# EAGLE design UTDTestBox_Rev1 (EAGLE 5.06)
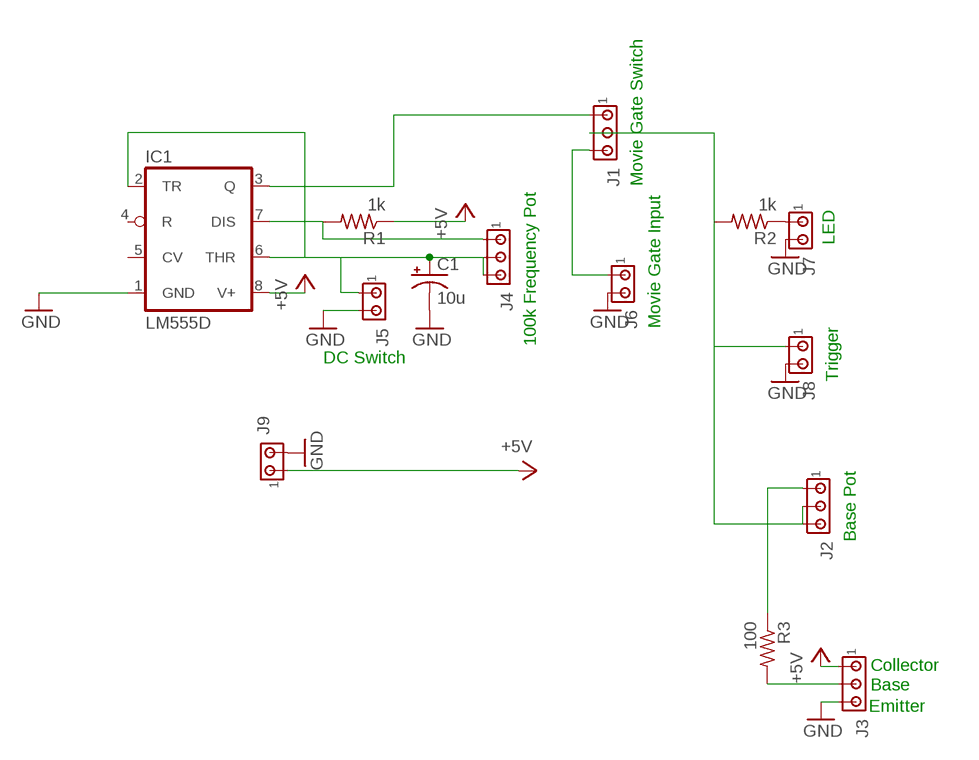
[diagram p0: schematic, sheet 1]

## Parts
C1  10u  CPOL-USE2.5-5  [E2,5-5]
IC1  LM555D  [SO08]
J1  MTA03-100  [10X03MTA]
J2  MTA03-100  [10X03MTA]
J3  MTA03-156  [1X3MTA]
J4  MTA03-100  [10X03MTA]
J5  MTA02-100  [10X02MTA]
J6  MTA02-100  [10X02MTA]
J7  MTA02-100  [10X02MTA]
J8  MTA02-100  [10X02MTA]
J9  MTA02-156  [1X2MTA]
R1  1k  R-US_0204/7  [0204/7]
R2  1k  R-US_0204/7  [0204/7]
R3  100  R-US_0204/7  [0204/7]

## Nets
+5V: IC1.8(V+) J3.1 J9.1 R1.1
GND: C1.- IC1.1(GND) J3.3 J5.2 J6.2 J7.2 J8.2 J9.2
N$1: C1.+ IC1.2(TR) IC1.6(THR) J4.2 J4.3 J5.1
N$2: IC1.7(DIS) J4.1 R1.2
N$3: IC1.3(Q) J1.1
N$4: J1.2 J2.2 J2.3 J8.1 R2.2
N$5: J1.3 J6.1
N$6: J7.1 R2.1
N$7: J2.1 R3.1
N$8: J3.2 R3.2
Unconnected: IC1.4(R) IC1.5(CV)

## Notes on the sheet
- Movie Gate Switch
- LED
- Movie Gate Input
- 100k Frequency Pot
- DC Switch
- Trigger
- Base Pot
- Collector
- Base
- Emitter

## Library data of the parts
C1 = rcl:CPOL-US: POLARIZED CAPACITOR, American symbol
IC1 = linear:*555: TIMER
J1 J2 J4 = con-amp:MTA03-100: AMP connector
J3 = con-amp:MTA03-156: AMP connector
J5-J8 = con-amp:MTA02-100: AMP connector
J9 = con-amp:MTA02-156: AMP connector
R1-R3 = rcl:R-US_: RESISTOR, American symbol

## Board
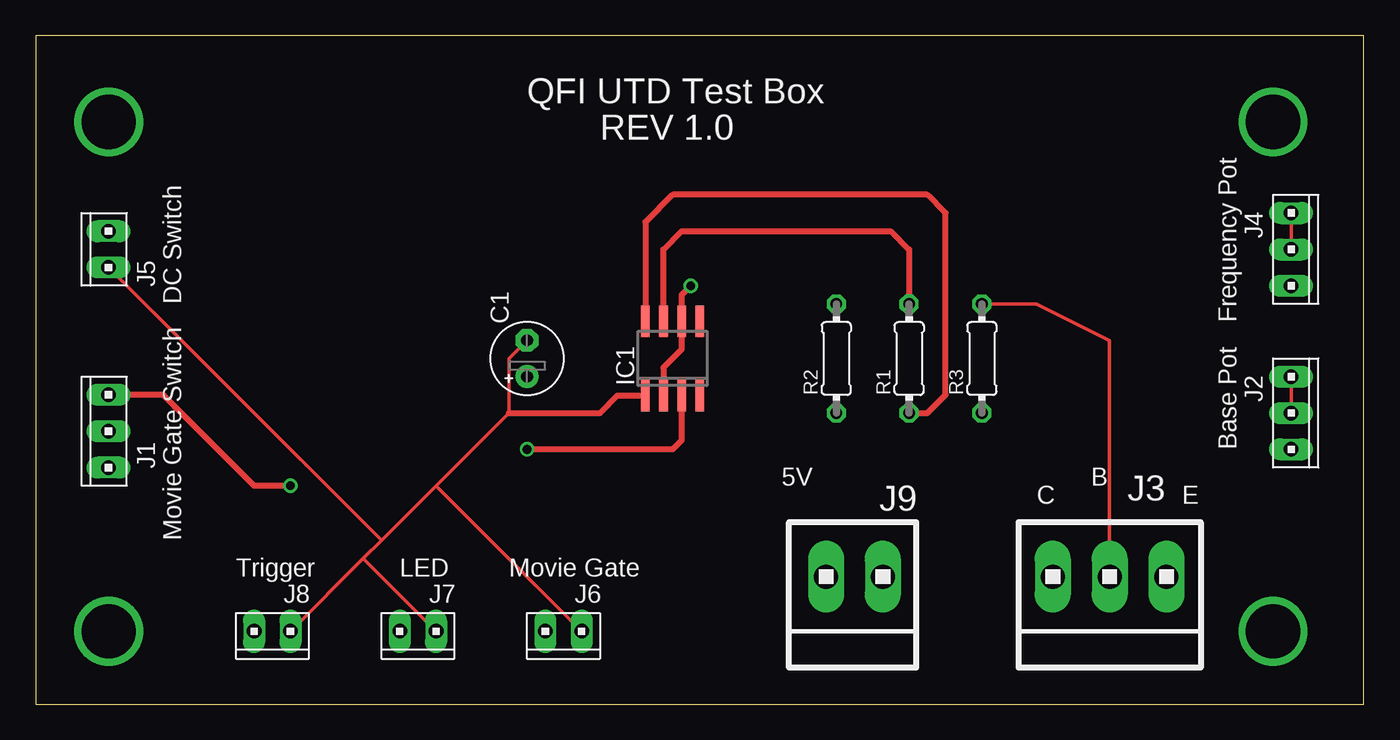
[diagram p1: board, top side]
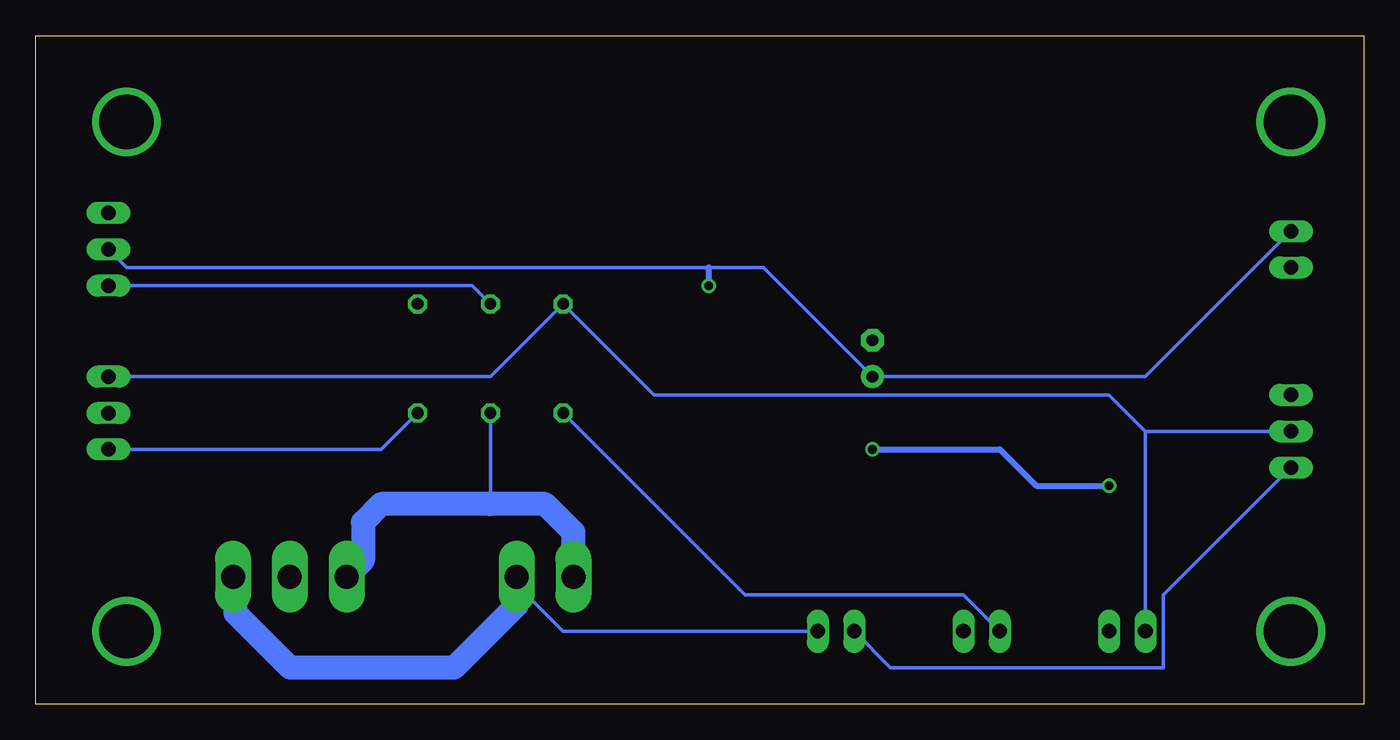
[diagram p2: board, bottom side, seen from below]

Size 92.69 x 46.66 mm. Coordinates in mm from the lower left corner, seen from the top.
Outline: 0,0 92.69,0 92.69,46.66 0,46.66 0,0
Copper layers (1*16): Top 0.035mm / dielectric 1.5mm / Bottom 0.035mm
Design rules "default": minimum track width 10mil, minimum drill 24mil, track to track 8mil, track to pad 8mil, pad to pad 8mil, via to via 8mil, smd to smd 8mil, copper to edge 40mil, drill to drill 8mil, minimum pad ring 10mil, minimum via ring 8mil, stop-mask expansion 4mil, vias tented up to drill 0mil, thermal gap 10mil

### Footprints (pad centres in the part's own frame; a part is rotated, then mirrored left to right if it is on the bottom)
E2,5-5 = drill 0.813 pad 1.6 round: + -1.27,0 | drill 0.813 pad 1.6 octagon: - 1.27,0
SO08 = smd 0.6 x 2.2: 1 -1.905,-2.6; 2 -0.635,-2.6; 3 0.635,-2.6; 4 1.905,-2.6; 5 1.905,2.6; 6 0.635,2.6; 7 -0.635,2.6; 8 -1.905,2.6
10X03MTA = drill 1.016 long: 1 2.54,0; 2 0,0; 3 -2.54,0
1X3MTA = drill 1.676 long: 1 3.937,0; 2 -0.025,0; 3 -3.988,0
10X02MTA = drill 1.016 long: 1 1.27,0; 2 -1.27,0
1X2MTA = drill 1.676 long: 1 1.981,0; 2 -1.981,0
0204/7 = drill 0.813 octagon: 1 -3.81,0; 2 3.81,0

### Placement (x,y rotation side)
C1  34.29,24.13 90 top
IC1  44.45,24.13 0 top
J1  5.08,19.05 90 top
J2  87.63,20.32 270 top
J3  74.93,8.89 180 top
J4  87.63,31.75 270 top
J5  5.08,31.75 90 top
J6  36.83,5.08 180 top
J7  26.67,5.08 180 top
J8  16.51,5.08 180 top
J9  57.15,8.89 180 top
R1  60.96,24.13 90 top
R2  55.88,24.13 90 top
R3  66.04,24.13 90 top

### Tracks (layer width: path | path; a pad name or v marks a point on that pad's centre or on a via)
+5V
  Top 0.406: IC1.8 42.55,33.66 44.45,35.56 62.23,35.56 63.5,34.29 63.5,21.59 62.23,20.32 R1.1
  Bottom 0.254: 60.96,13.97 R1.1
  Bottom 1.676: J9.1 55.17,11.99 57.15,13.97 60.96,13.97 68.58,13.97 69.85,12.7 69.85,10.03 J3.1
GND
  Top 0.254: 27.94,15.24 33.02,20.32 33.02,24.13 C1.- | 24.13,11.43 27.94,15.24 | 22.86,10.16 24.13,11.43 | J8.2 22.86,10.16 | 24.13,11.43 J5.2 | 22.86,10.16 J7.2 | 27.94,15.24 J6.2
  Top 0.406: IC1.1 40.58,21.53 39.37,20.32 33.02,20.32
  Bottom 0.254: J6.2 55.88,5.08 58.42,7.62 J9.2
  Bottom 1.676: J9.2 59.13,6.91 63.5,2.54 74.93,2.54 78.74,6.35 78.74,8.71 J3.3
N$1  (via drill 0.6)
  Top 0.254: J4.2 J4.3
  Top 0.406: IC1.2 43.81,23.5 45.09,24.77 IC1.6 45.09,28.57 v45.72,29.21
  Bottom 0.254: J5.1 15.24,22.86 C1.+ 41.91,30.48 45.72,30.48 86.36,30.48 J4.2
  Bottom 0.406: 45.72,30.48 v45.72,29.21
N$2
  Top 0.406: IC1.7 43.81,31.75 45.09,33.02 59.69,33.02 60.96,31.75 R1.2
  Bottom 0.254: R1.2 62.23,29.21 J4.1
N$3  (via drill 0.6)
  Top 0.406: IC1.3 45.09,18.41 44.45,17.78 v34.29,17.78 | v17.78,15.24 15.24,15.24 8.89,21.59 J1.1
  Bottom 0.406: v34.29,17.78 25.4,17.78 22.86,15.24 v17.78,15.24
N$4
  Top 0.254: J2.3 J2.2
  Bottom 0.254: J8.1 15.24,19.05 | 15.24,19.05 J1.2 | J2.3 60.96,22.86 R2.2 49.53,21.59 17.78,21.59 15.24,19.05
N$5
  Bottom 0.254: J1.3 13.97,7.62 13.97,2.54 33.02,2.54 J6.1
N$6
  Bottom 0.254: R2.1 43.18,7.62 27.94,7.62 J7.1
N$7
  Bottom 0.254: R3.1 68.58,17.78 J2.1
N$8
  Top 0.254: R3.2 69.85,27.94 74.93,25.4 74.93,8.89 J3.2
N$9  (via drill 3.78)
  other vias: 5.08,40.64
N$10  (via drill 3.78)
  other vias: 86.36,40.64
N$11  (via drill 3.78)
  other vias: 86.36,5.08
N$12  (via drill 3.78)
  other vias: 5.08,5.08

### Text on the board
tNames: QFI UTD Test Box | REV 1.0 | DC Switch | Frequency Pot | Base Pot | 5V | B | C | E | Movie Gate Switch | Trigger | LED | Movie Gate